# Altium project OwlRoundDelay.PrjPcb
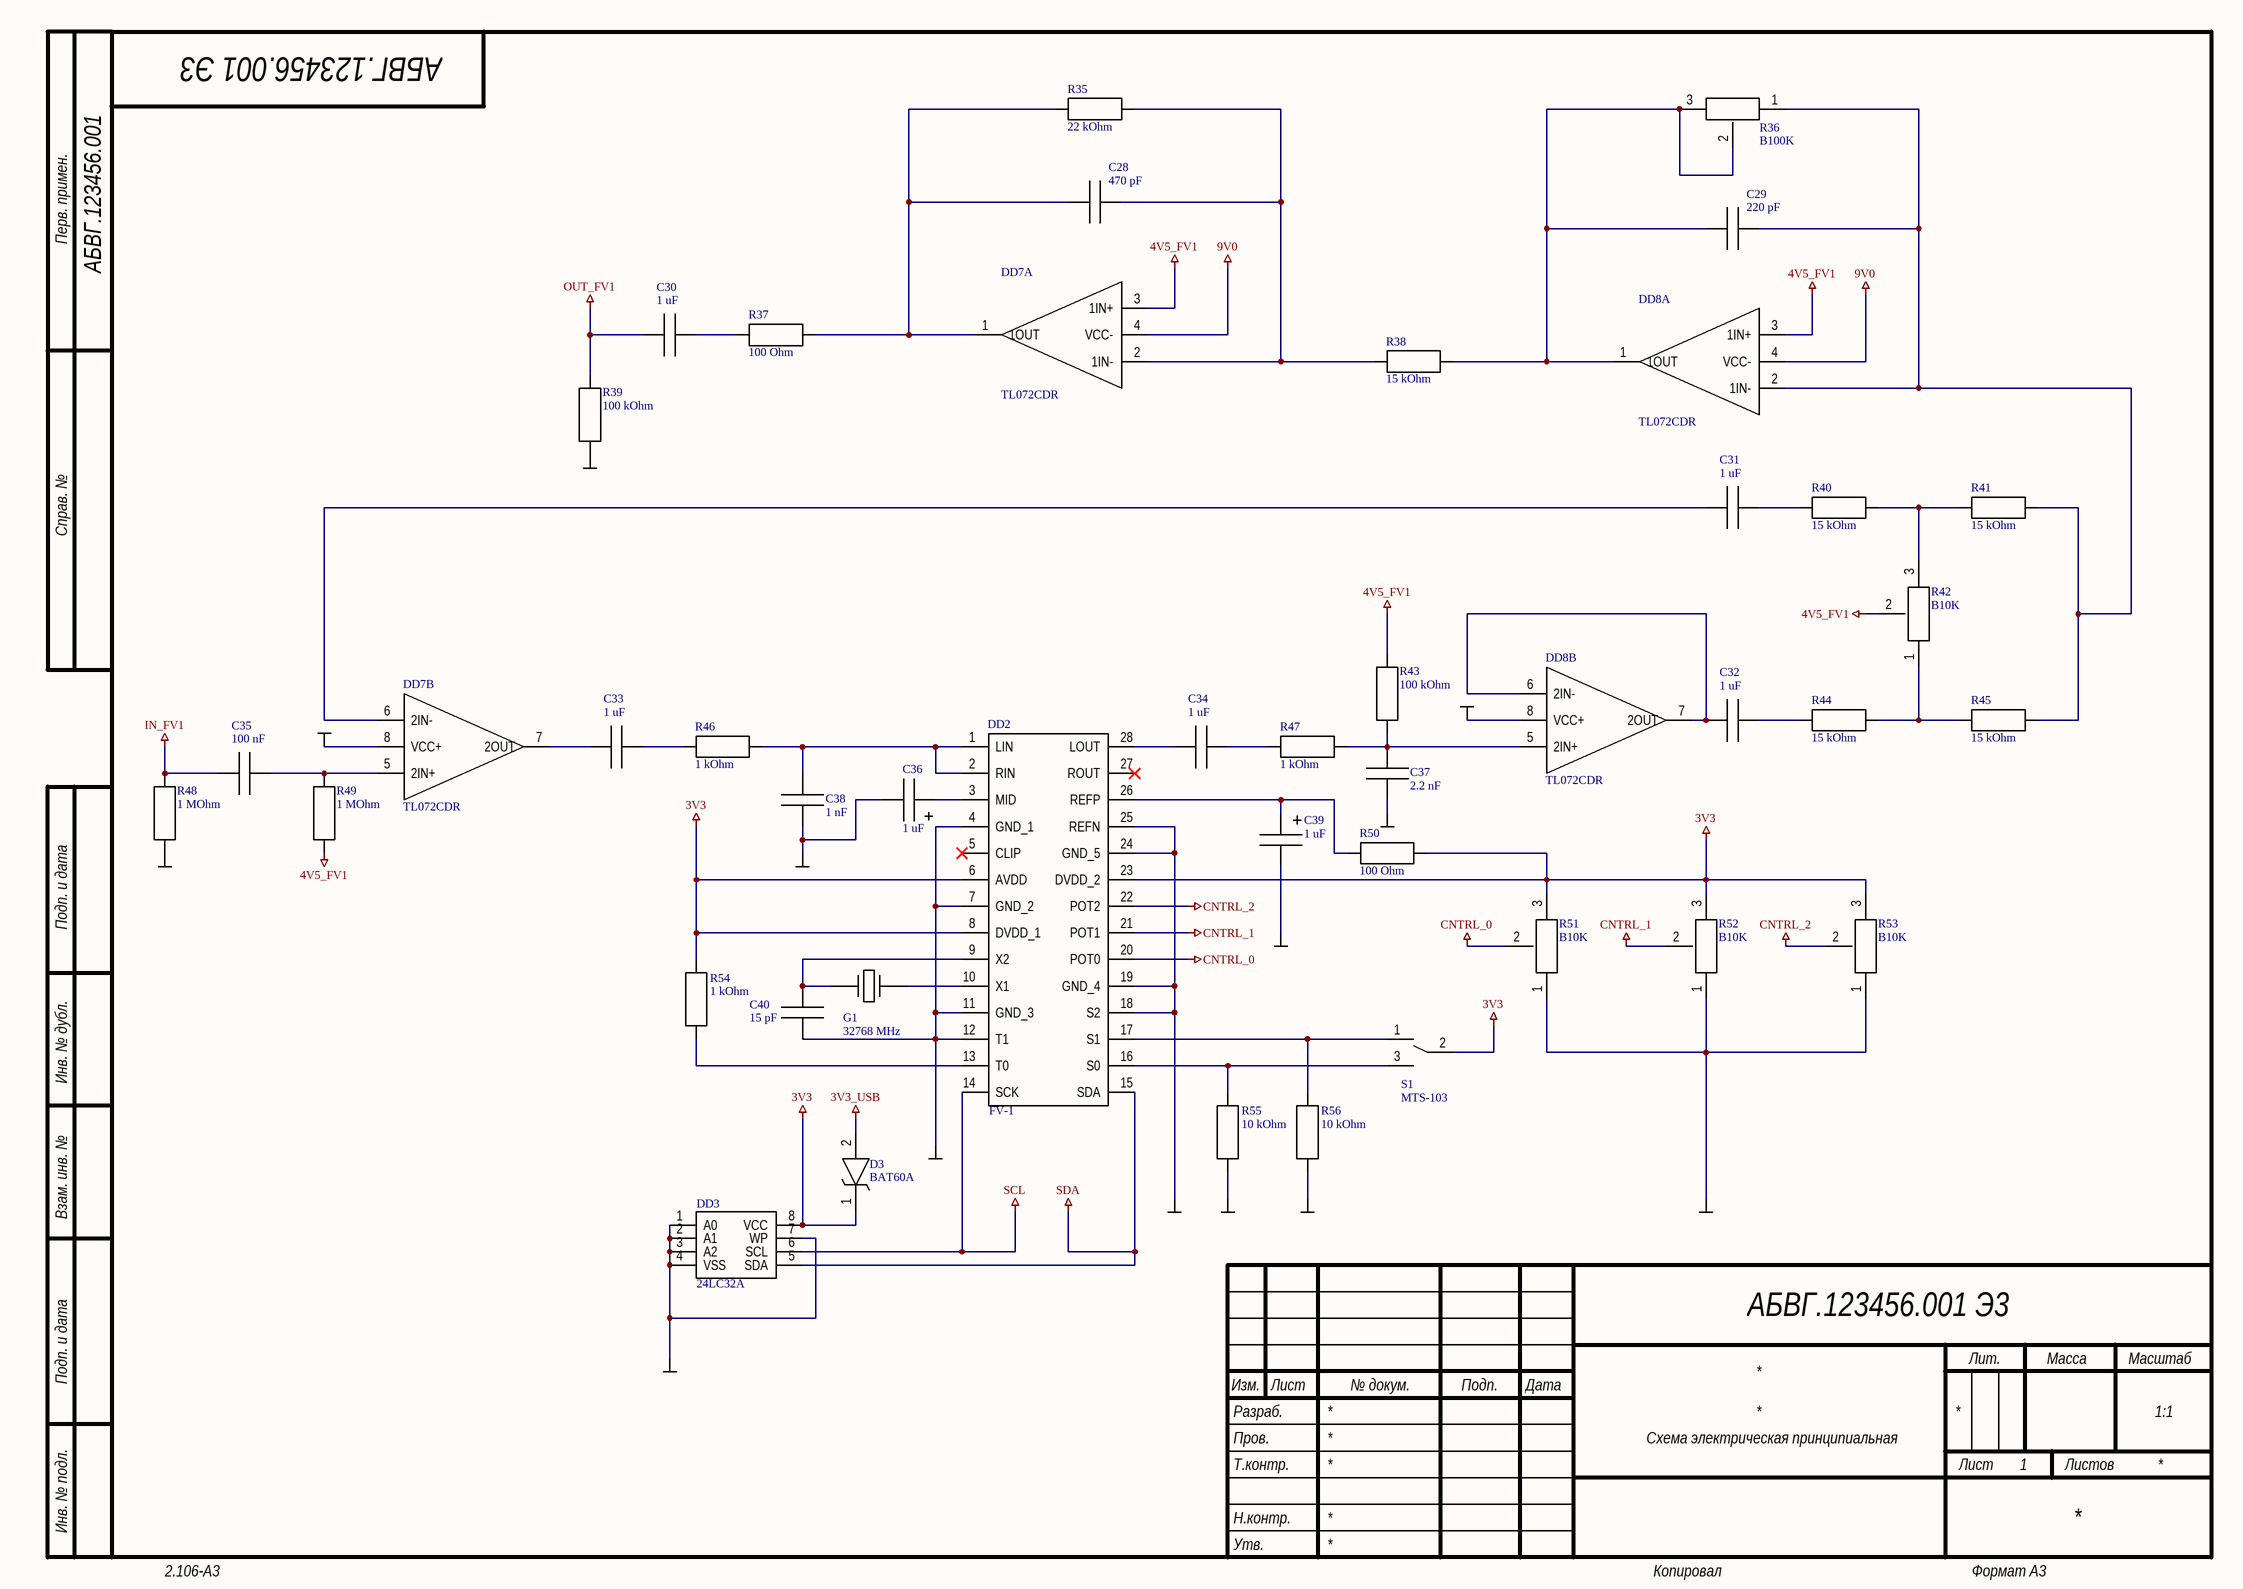
[diagram p0: ORD_FV1.SchDoc]
5 sheets, 130 parts. Net scope: global (net labels, ports and power ports of the same name join across sheets).
Board file: ORD_PCB.PcbDoc
Sheets:
  ORD_FV1.SchDoc
  ORD_PT2399.SchDoc
  ORD_POWER.SchDoc
  ORD_CH341A.SchDoc
  ORD_CONNECTORS.SchDoc

## Sheet ORD_FV1.SchDoc
size 420 x 297 mm; Address1: Address1; Address2: Address2; Address3: Address3; Address4: Address4; DocumentNumber: АБВГ.123456.001 Э3; SheetNumber: 1; Scale: 1:1; DocumentType: Схема электрическая принципиальная; FirstReferrence: АБВГ.123456.001

### Parts
C28  470 pF  [C0805[2012]]
C29  220 pF  [C0805[2012]]
C30  1 uF  [C0805[2012]]
C31  1 uF  [C0805[2012]]
C32  1 uF  [C0805[2012]]
C33  1 uF  [C0805[2012]]
C34  1 uF  [C0805[2012]]
C35  100 nF  [C0805[2012]]
C36  1 uF  [C3216_CASE-A]
C37  2.2 nF  [C0805[2012]]
C38  1 nF  [C0805[2012]]
C39  1 uF  [C3216_CASE-A]
C40  15 pF  [C0805[2012]]
D3  BAT60A  [SOD323]
DD2  FV-1  [SOIC28]
DD3  24LC32A  [DIP8_WITH_SOCKET]
DD7  TL072CDR  [SO8]  (parts A,B of 2)
DD8  TL072CDR  [SO8]  (parts A,B of 2)
G1  32768 MHz  [HC-49]
R35  22 kOhm  [R0805[2012]]
R36  B100K  [16K1]
R37  100 Ohm  [R0805[2012]]
R38  15 kOhm  [R0805[2012]]
R39  100 kOhm  [R0805[2012]]
R40  15 kOhm  [R0805[2012]]
R41  15 kOhm  [R0805[2012]]
R42  B10K  [16K1]
R43  100 kOhm  [R0805[2012]]
R44  15 kOhm  [R0805[2012]]
R45  15 kOhm  [R0805[2012]]
R46  1 kOhm  [R0805[2012]]
R47  1 kOhm  [R0805[2012]]
R48  1 MOhm  [R0805[2012]]
R49  1 MOhm  [R0805[2012]]
R50  100 Ohm  [R0805[2012]]
R51  B10K  [16K1]
R52  B10K  [16K1]
R53  B10K  [16K1]
R54  1 kOhm  [R0805[2012]]
R55  10 kOhm  [R0805[2012]]
R56  10 kOhm  [R0805[2012]]
S1  MTS-103  [MTS-103]

### Nets
3V3: D3.1(K) DD2.6(AVDD) DD2.8(DVDD_1) DD2.23(DVDD_2) DD3.8(VCC) R50.1 R51.3 R52.3 R53.3 R54.2 S1.2
3V3_USB: D3.2(A)
4V5_FV1: DD7.3(1IN+) DD8.3(1IN+) R42.2 R43.1 R49.1
9V0: DD7.4(VCC-) DD8.4(VCC-)
CNTRL_0: DD2.20(POT0) R51.2
CNTRL_1: DD2.21(POT1) R52.2
CNTRL_2: DD2.22(POT2) R53.2
GND: C36.2 C37.1 C38.1 C39.2 C40.2 DD2.4(GND_1) DD2.7(GND_2) DD2.11(GND_3) DD2.12(T1) DD2.18(S2) DD2.19(GND_4) DD2.24(GND_5) DD2.25(REFN) DD3.1(A0) DD3.2(A1) DD3.3(A2) DD3.4(VSS) DD3.7(WP) DD7.8(VCC+) DD8.8(VCC+) R39.1 R48.1 R51.1 R52.1 R53.1 R55.1 R56.1
IN_FV1: C35.1 R48.2
OUT_FV1: C30.1 R39.2
SCL: DD2.14(SCK) DD3.6(SCL)
SDA: DD2.15(SDA) DD3.5(SDA)
NetC28_1: C28.1 DD7.1(1OUT) R35.2 R37.1
NetC28_2: C28.2 DD7.2(1IN-) R35.1 R38.2
NetC29_1: C29.1 DD8.1(1OUT) R36.2 R36.3 R38.1
NetC29_2: C29.2 DD8.2(1IN-) R36.1 R41.1 R45.1
NetC30_2: C30.2 R37.2
NetC31_1: C31.1 DD7.6(2IN-)
NetC31_2: C31.2 R40.2
NetC32_1: C32.1 DD8.6(2IN-) DD8.7(2OUT)
NetC32_2: C32.2 R44.2
NetC33_1: C33.1 DD7.7(2OUT)
NetC33_2: C33.2 R46.2
NetC34_1: C34.1 DD2.28(LOUT)
NetC34_2: C34.2 R47.2
NetC35_2: C35.2 DD7.5(2IN+) R49.2
NetC36_1: C36.1 DD2.3(MID)
NetC37_2: C37.2 DD8.5(2IN+) R43.2 R47.1
NetC38_2: C38.2 DD2.1(LIN) DD2.2(RIN) R46.1
NetC39_1: C39.1 DD2.26(REFP) R50.2
NetC40_1: C40.1 DD2.9(X2) G1.1
NetDD2_10: DD2.10(X1) G1.2
NetDD2_13: DD2.13(T0) R54.1
NetDD2_16: DD2.16(S0) R55.2 S1.3
NetDD2_17: DD2.17(S1) R56.2 S1.1
NetR40_1: R40.1 R41.2 R42.3
NetR42_1: R42.1 R44.1 R45.2

Not connected (* = marked no-connect by the designer): DD2 5(CLIP)* 27(ROUT)*

### Notes on the sheet
- Перв. примен.
- Справ. №
- Подп. и дата
- Инв. № дубл.
- Взам. инв. №
- Разраб.
- Изм.
- Лист
- № докум.
- Подп.
- Дата
- Лит.
- Масса
- Масштаб
- Пров.
- Т.контр.
- Листов
- Инв. № подл.
- Утв.
- Н.контр.
- 2.106-A3
- Копировал
- Формат А3

### Library data of the parts
C28-C35 C37 C38 C40 = Capacitor: Manufacture: *; ManufacturerPartNumber: *; Power/Voltage: *; Quantity: *; Rem: *; TKE: *; Tolerance: *; Корпус: *; Примечание: *
  C28: Value: 470 pF
  C29: Value: 220 pF
  C30-C34: Value: 1 uF
  C35: Value: 100 nF
  C37: Value: 2.2 nF
  C38: Value: 1 nF
  C40: Value: 15 pF
C36 C39 = Capacitor_Pol: Manufacture: *; ManufacturerPartNumber: *; Power/Voltage: *; Quantity: *; Rem: *; TKE: *; Tolerance: *; Value: 1 uF; Корпус: *; Примечание: *
D3 = BAT60A: Diode Schottky 10V 3A Automotive 2-Pin SOD-323 T/R; Manufacturer_Part_Number: BAT60A; Arrow Part Number: BAT60A
DD2 = FV-1: FV-1 Reverb IC, Integrated Stereo ADC & DAC, Integrated Circuit, SOIC-28 300 MIL; Manufacturer_Name: Spin Semiconductor; Geometry.Height: 2.51mm; Manufacturer_Part_Number: FV-1 Reverb IC; Mouser Part Number: *; Mouser Price/Stock: *; RS Part Number: *; RS Price/Stock: *; Datasheet Link: http://www.spinsemi.com/Products/datasheets/spn1001/FV-1.pdf
DD3 = 24LC32A: 32K I2C Serial EEPROM with Quarter-Array Write-Protect; Manufacturer_Name: Microchip; Manufacturer_Part_Number: 24LC32AF-I/P; Allied_Number: 70570177; Mouser Part Number: 579-24LC32AF-I/P; Mouser Price/Stock: https://www.mouser.com/Search/Refine.aspx?Keyword=579-24LC32AF-I%2FP; RS Part Number: *; RS Price/Stock: *; Allied Price/Stock: https://www.alliedelec.com/microchip-technology-inc-24lc32af-i-p/70570177/; Datasheet Link: *
DD7 DD8 = TL072CDR: TL072CDR, Dual Operational Amplifier 4 MHz -18 to 18V, 8-Pin SO; Manufacturer_Name: STMicroelectronics; Manufacturer_Part_Number: LM358DT; Allied_Number: 70013708; Geometry.Height: 1.75mm; Mouser Part Number: 511-LM358DT; Mouser Price/Stock: https://www.mouser.com/Search/Refine.aspx?Keyword=511-LM358DT; RS Part Number: 7140827P; RS Price/Stock: http://uk.rs-online.com/web/p/products/7140827P; Allied Price/Stock: http://www.alliedelec.com/stmicroelectronics-lm358dt/70013708/; Datasheet Link: http://www.st.com/st-web-ui/static/active/en/resource/technical/document/datasheet/CD00000464.pdf
G1 = Crystal_2pin: Value: *
R35 R37-R41 R43-R50 R54-R56 = Resistor: Manufacture: *; ManufacturerPartNumber: *; Power/Voltage: *; Quantity: *; Rem: *; TKE: *; Tolerance: *; Корпус: *; Примечание: *
  R35: Value: 22 kOhm
  R37 R50: Value: 100 Ohm
  R38 R40 R41 R44 R45: Value: 15 kOhm
  R39 R43: Value: 100 kOhm
  R46 R47 R54: Value: 1 kOhm
  R48 R49: Value: 1 MOhm
  R55 R56: Value: 10 kOhm
R36 R42 R51-R53 = 16K1-B (Pot): Value: *; Function: *
S1 = MTS-103: Switch, ON-OFF-ON

## Sheet ORD_PT2399.SchDoc
size 420 x 297 mm; Address1: Address1; Address2: Address2; Address3: Address3; Address4: Address4; DocumentNumber: АБВГ.123456.001 Э3; SheetNumber: 1; Scale: 1:1; DocumentType: Схема электрическая принципиальная; FirstReferrence: АБВГ.123456.001
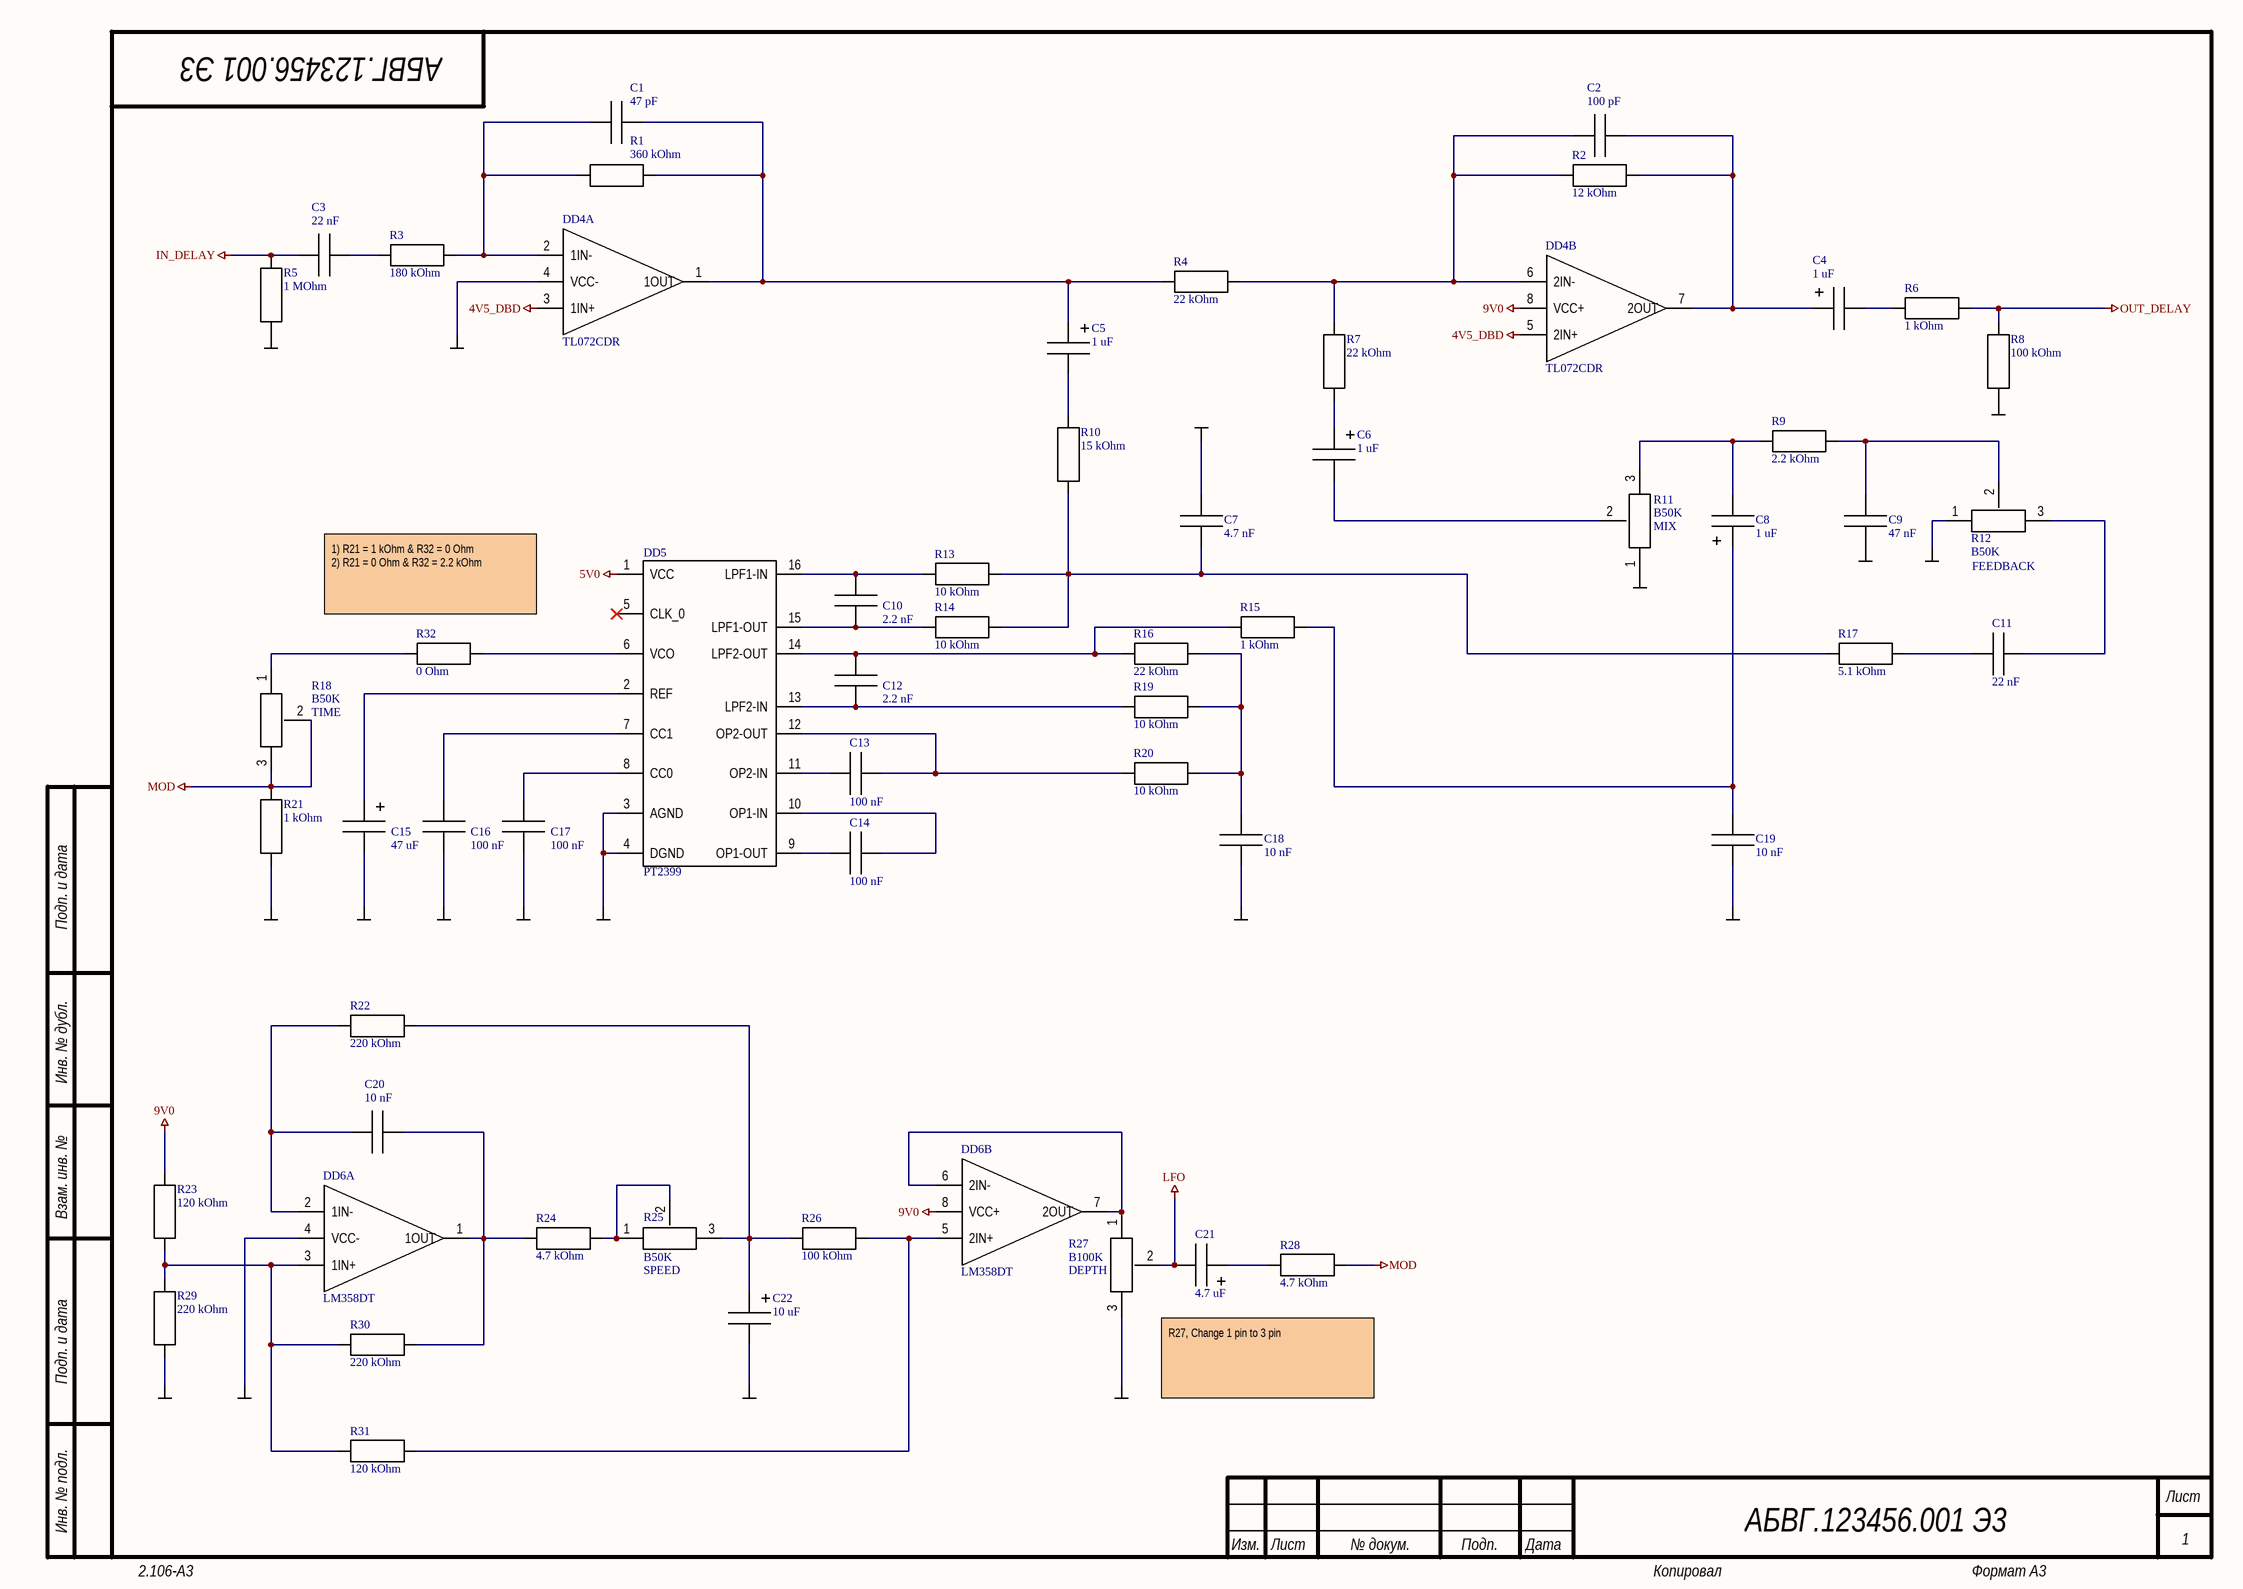
[diagram p1: ORD_PT2399.SchDoc]

### Parts
C1  47 pF  [C0805[2012]]
C2  100 pF  [C0805[2012]]
C3  22 nF  [C0805[2012]]
C4  1 uF  [C3216_CASE-A]
C5  1 uF  [C3216_CASE-A]
C6  1 uF  [C3216_CASE-A]
C7  4.7 nF  [C0805[2012]]
C8  1 uF  [C3216_CASE-A]
C9  47 nF  [C0805[2012]]
C10  2.2 nF  [C0805[2012]]
C11  22 nF  [C0805[2012]]
C12  2.2 nF  [C0805[2012]]
C13  100 nF  [C0805[2012]]
C14  100 nF  [C0805[2012]]
C15  47 uF  [C3216_CASE-A]
C16  100 nF  [C0805[2012]]
C17  100 nF  [C0805[2012]]
C18  10 nF  [C0805[2012]]
C19  10 nF  [C0805[2012]]
C20  10 nF  [C0805[2012]]
C21  4.7 uF  [C3216_CASE-A]
C22  10 uF  [C3216_CASE-A]
DD4  TL072CDR  [SO8]  (parts A,B of 2)
DD5  PT2399  [DIP16_with_Socket]
DD6  LM358DT  [SO8]  (parts A,B of 2)
R1  360 kOhm  [R0805[2012]]
R2  12 kOhm  [R0805[2012]]
R3  180 kOhm  [R0805[2012]]
R4  22 kOhm  [R0805[2012]]
R5  1 MOhm  [R0805[2012]]
R6  1 kOhm  [R0805[2012]]
R7  22 kOhm  [R0805[2012]]
R8  100 kOhm  [R0805[2012]]
R9  2.2 kOhm  [R0805[2012]]
R10  15 kOhm  [R0805[2012]]
R11  B50K  [16K1]
R12  B50K  [16K1]
R13  10 kOhm  [R0805[2012]]
R14  10 kOhm  [R0805[2012]]
R15  1 kOhm  [R0805[2012]]
R16  22 kOhm  [R0805[2012]]
R17  5.1 kOhm  [R0805[2012]]
R18  B50K  [16K1]
R19  10 kOhm  [R0805[2012]]
R20  10 kOhm  [R0805[2012]]
R21  1 kOhm  [R0805[2012]]
R22  220 kOhm  [R0805[2012]]
R23  120 kOhm  [R0805[2012]]
R24  4.7 kOhm  [R0805[2012]]
R25  B50K  [16K1]
R26  100 kOhm  [R0805[2012]]
R27  B100K  [16K1]
R28  4.7 kOhm  [R0805[2012]]
R29  220 kOhm  [R0805[2012]]
R30  220 kOhm  [R0805[2012]]
R31  120 kOhm  [R0805[2012]]
R32  0 Ohm  [R0805[2012]]

### Nets
4V5_DBD: DD4.3(1IN+) DD4.5(2IN+)
5V0: DD5.1(VCC)
9V0: DD4.8(VCC+) DD6.8(VCC+) R23.1
GND: C7.1 C9.2 C15.2 C16.1 C17.1 C18.2 C19.2 C22.2 DD4.4(VCC-) DD5.3(AGND) DD5.4(DGND) DD6.4(VCC-) R5.1 R8.2 R11.1 R12.1 R21.1 R27.3 R29.2
IN_DELAY: C3.1 R5.2
LFO: C21.2 R27.2
MOD: R18.2 R18.3 R21.2 R28.2
OUT_DELAY: R6.1 R8.1
NetC1_1: C1.1 DD4.2(1IN-) R1.2 R3.1
NetC1_2: C1.2 C5.1 DD4.1(1OUT) R1.1 R4.2
NetC2_1: C2.1 DD4.6(2IN-) R2.2 R4.1 R7.1
NetC2_2: C2.2 C4.1 DD4.7(2OUT) R2.1
NetC3_2: C3.2 R3.2
NetC4_2: C4.2 R6.2
NetC5_2: C5.2 R10.1
NetC6_1: C6.1 R7.2
NetC6_2: C6.2 R11.2
NetC7_2: C7.2 R10.2 R13.2 R14.2 R17.1
NetC8_1: C8.1 C19.1 R15.2
NetC8_2: C8.2 R9.1 R11.3
NetC9_1: C9.1 R9.2 R12.2
NetC10_1: C10.1 DD5.15(LPF1-OUT) R14.1
NetC10_2: C10.2 DD5.16(LPF1-IN) R13.1
NetC11_1: C11.1 R17.2
NetC11_2: C11.2 R12.3
NetC12_1: C12.1 DD5.13(LPF2-IN) R19.1
NetC12_2: C12.2 DD5.14(LPF2-OUT) R15.1 R16.1
NetC13_1: C13.1 DD5.12(OP2-OUT) R20.1
NetC13_2: C13.2 DD5.11(OP2-IN)
NetC14_1: C14.1 DD5.10(OP1-IN)
NetC14_2: C14.2 DD5.9(OP1-OUT)
NetC15_1: C15.1 DD5.2(REF)
NetC16_2: C16.2 DD5.7(CC1)
NetC17_2: C17.2 DD5.8(CC0)
NetC18_1: C18.1 R16.2 R19.2 R20.2
NetC20_1: C20.1 DD6.2(1IN-) R22.1
NetC20_2: C20.2 DD6.1(1OUT) R24.1 R30.2
NetC21_1: C21.1 R28.1
NetC22_1: C22.1 R22.2 R25.3 R26.1
NetDD5_6: DD5.6(VCO) R32.1
NetDD6_3: DD6.3(1IN+) R23.2 R29.1 R30.1 R31.1
NetDD6_5: DD6.5(2IN+) R26.2 R31.2
NetDD6_6: DD6.6(2IN-) DD6.7(2OUT) R27.1
NetR18_1: R18.1 R32.2
NetR24_2: R24.2 R25.1 R25.2

Not connected (* = marked no-connect by the designer): DD5 5(CLK_0)*

### Notes on the sheet
- (near R11) MIX
- (near R12) FEEDBACK
- (near R32) 1) R21 = 1 kOhm & R32 = 0 Ohm
  2) R21 = 0 Ohm & R32 = 2.2 kOhm
- (near R18) TIME
- (near R25) SPEED
- DEPTH
- R27, Change 1 pin to 3 pin
- Подп. и дата
- Инв. № дубл.
- Взам. инв. №
- Инв. № подл.
- Изм.
- Лист
- № докум.
- Подп.
- Дата
- 2.106-A3
- Копировал
- Формат А3

### Library data of the parts
C1-C3 C7 C9-C14 C16-C20 = Capacitor: Manufacture: *; ManufacturerPartNumber: *; Power/Voltage: *; Quantity: *; Rem: *; TKE: *; Tolerance: *; Корпус: *; Примечание: *
  C1: Value: 47 pF
  C2: Value: 100 pF
  C3 C11: Value: 22 nF
  C7: Value: 4.7 nF
  C9: Value: 47 nF
  C10 C12: Value: 2.2 nF
  C13 C14 C16 C17: Value: 100 nF
  C18-C20: Value: 10 nF
C4-C6 C8 C15 C21 C22 = Capacitor_Pol: Manufacture: *; ManufacturerPartNumber: *; Power/Voltage: *; Quantity: *; Rem: *; TKE: *; Tolerance: *; Корпус: *; Примечание: *
  C4-C6 C8: Value: 1 uF
  C15: Value: 47 uF
  C21: Value: 4.7 uF
  C22: Value: 10 uF
DD4 = TL072CDR: as DD7 on sheet ORD_FV1; Mouser Part Number: 511-LM358DT; Mouser Price/Stock: https://www.mouser.com/Search/Refine.aspx?Keyword=511-LM358DT; RS Part Number: 7140827P; RS Price/Stock: http://uk.rs-online.com/web/p/products/7140827P; Allied Price/Stock: http://www.alliedelec.com/stmicroelectronics-lm358dt/70013708/; Datasheet Link: http://www.st.com/st-web-ui/static/active/en/resource/technical/document/datasheet/CD00000464.pdf
DD5 = PT2399: Echo Processor IC; Manufacturer_Name: Princeton Technology Corp; Geometry.Height: 5.33mm; Manufacturer_Part_Number: PT2399; Mouser Part Number: *; Mouser Price/Stock: *; RS Part Number: *; RS Price/Stock: *; Datasheet Link: http://www.princeton.com.tw/Portals/0/Product/PT2399_1.pdf
DD6 = LM358DT: LM358DT, Dual Operational Amplifier 1.1MHz 5 to 28V, 8-Pin SO; Manufacturer_Name: STMicroelectronics; Allied_Number: 70013708; Geometry.Height: 1.75mm; Manufacturer_Part_Number: LM358DT; Mouser Part Number: 511-LM358DT; Mouser Price/Stock: https://www.mouser.com/Search/Refine.aspx?Keyword=511-LM358DT; RS Part Number: 7140827P; RS Price/Stock: http://uk.rs-online.com/web/p/products/7140827P; Allied Price/Stock: http://www.alliedelec.com/stmicroelectronics-lm358dt/70013708/; Datasheet Link: http://www.st.com/st-web-ui/static/active/en/resource/technical/document/datasheet/CD00000464.pdf
R1-R10 R13-R17 R19-R24 R26 R28-R32 = Resistor: Manufacture: *; ManufacturerPartNumber: *; Power/Voltage: *; Quantity: *; Rem: *; TKE: *; Tolerance: *; Корпус: *; Примечание: *
  R1: Value: 360 kOhm
  R2: Value: 12 kOhm
  R3: Value: 180 kOhm
  R4 R7 R16: Value: 22 kOhm
  R5: Value: 1 MOhm
  R6 R15 R21: Value: 1 kOhm
  R8 R26: Value: 100 kOhm
  R9: Value: 2.2 kOhm
  R10: Value: 15 kOhm
  R13 R14 R19 R20: Value: 10 kOhm
  R17: Value: 5.1 kOhm
  R22 R29 R30: Value: 220 kOhm
  R23 R31: Value: 120 kOhm
  R24 R28: Value: 4.7 kOhm
  R32: Value: 0 Ohm
R11 R12 R18 R25 R27 = 16K1-B (Pot): Value: *; Function: *

## Sheet ORD_POWER.SchDoc
size 420 x 297 mm; Address1: Address1; Address2: Address2; Address3: Address3; Address4: Address4; DocumentNumber: АБВГ.123456.001 Э3; SheetNumber: 1; Scale: 1:1; DocumentType: Схема электрическая принципиальная; FirstReferrence: АБВГ.123456.001
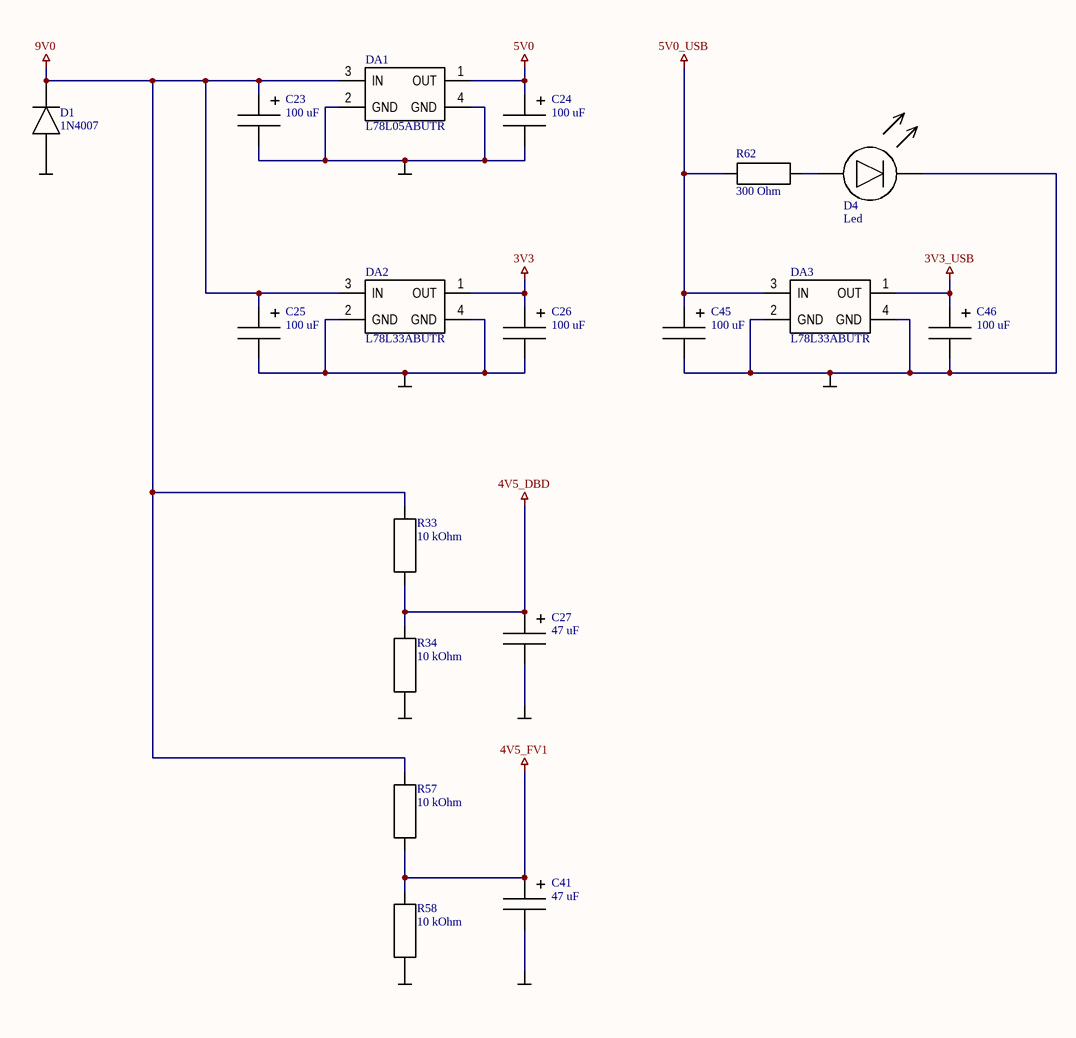
[diagram p2: ORD_POWER.SchDoc]

### Parts
C23  100 uF  [K50-35]
C24  100 uF  [K50-35]
C25  100 uF  [K50-35]
C26  100 uF  [K50-35]
C27  47 uF  [C3528_CASE-B]
C41  47 uF  [C3528_CASE-B]
C45  100 uF  [K50-35]
C46  100 uF  [K50-35]
D1  1N4007  [DO-41]
D4  Led  [LED]
DA1  L78L05ABUTR  [SOT-89]
DA2  L78L33ABUTR  [SOT-89]
DA3  L78L33ABUTR  [SOT-89]
R33  10 kOhm  [R0805[2012]]
R34  10 kOhm  [R0805[2012]]
R57  10 kOhm  [R0805[2012]]
R58  10 kOhm  [R0805[2012]]
R62  300 Ohm  [R0805[2012]]

### Nets
3V3: C26.1 DA2.1(OUT)
3V3_USB: C46.1 DA3.1(OUT)
4V5_DBD: C27.1 R33.1 R34.2
4V5_FV1: C41.1 R57.1 R58.2
5V0: C24.1 DA1.1(OUT)
5V0_USB: C45.1 DA3.3(IN) R62.2
9V0: C23.1 C25.1 D1.1(K) DA1.3(IN) DA2.3(IN) R33.2 R57.2
GND: C23.2 C24.2 C25.2 C26.2 C27.2 C41.2 C45.2 C46.2 D1.2(A) D4.2 DA1.2(GND) DA1.4(GND) DA2.2(GND) DA2.4(GND) DA3.2(GND) DA3.4(GND) R34.1 R58.1
NetD4_1: D4.1 R62.1

### Notes on the sheet
- Перв. примен.
- Справ. №
- Подп. и дата
- Инв. № дубл.
- Взам. инв. №
- Разраб.
- Изм.
- Лист
- № докум.
- Подп.
- Дата
- Лит.
- Масса
- Масштаб
- Пров.
- Т.контр.
- Листов
- Инв. № подл.
- Утв.
- Н.контр.
- 2.106-A3
- Копировал
- Формат А3

### Library data of the parts
C23-C27 C41 C45 C46 = Capacitor_Pol: Manufacture: *; ManufacturerPartNumber: *; Power/Voltage: *; Quantity: *; Rem: *; TKE: *; Tolerance: *; Корпус: *; Примечание: *
  C23-C26 C45 C46: Value: 100 uF
  C27 C41: Value: 47 uF
D1 = 1N4007: Geometry.Height: 1.35mm; Manufacturer_Name: 1N4007; Manufacturer_Part_Number: 1N4007
DA1 = L78L05ABUTR: Standard Regulator Pos 5V 0.1A L78L05ABUTR, Single Linear Voltage Regulator, 100mA 5 V, 3-Pin SOT-89; Manufacturer_Name: New Japan Radio; Manufacturer_Part_Number: NJM78L05UA-TE1; Allied_Number: R1030699; Mouser Part Number: *; Mouser Price/Stock: *; RS Part Number: 7139502P; RS Price/Stock: http://uk.rs-online.com/web/p/products/7139502P; Allied Price/Stock: https://www.alliedelec.com/new-japan-radio-njm78l05ua-te1/R1030699/; Datasheet Link: http://uk.rs-online.com/web/p/products/7139502
DA2 DA3 = L78L33ABUTR: Standard Regulator Pos 3.3V 0.1A L78L33ABUTR, Single Linear Voltage Regulator, 100mA 3.3 V, 3-Pin SOT-89; Manufacturer_Name: New Japan Radio; Manufacturer_Part_Number: NJM78L05UA-TE1; Allied_Number: R1030699; Mouser Part Number: *; Mouser Price/Stock: *; RS Part Number: 7139502P; RS Price/Stock: http://uk.rs-online.com/web/p/products/7139502P; Allied Price/Stock: https://www.alliedelec.com/new-japan-radio-njm78l05ua-te1/R1030699/; Datasheet Link: http://uk.rs-online.com/web/p/products/7139502
R33 R34 R57 R58 R62 = Resistor: Manufacture: *; ManufacturerPartNumber: *; Power/Voltage: *; Quantity: *; Rem: *; TKE: *; Tolerance: *; Корпус: *; Примечание: *
  R33 R34 R57 R58: Value: 10 kOhm
  R62: Value: 300 Ohm
D4 = Led: ManufacturerPartNumber: *

## Sheet ORD_CH341A.SchDoc
size 420 x 297 mm; Address1: Address1; Address2: Address2; Address3: Address3; Address4: Address4; DocumentNumber: АБВГ.123456.001 Э3; SheetNumber: 1; Scale: 1:1; DocumentType: Схема электрическая принципиальная; FirstReferrence: АБВГ.123456.001
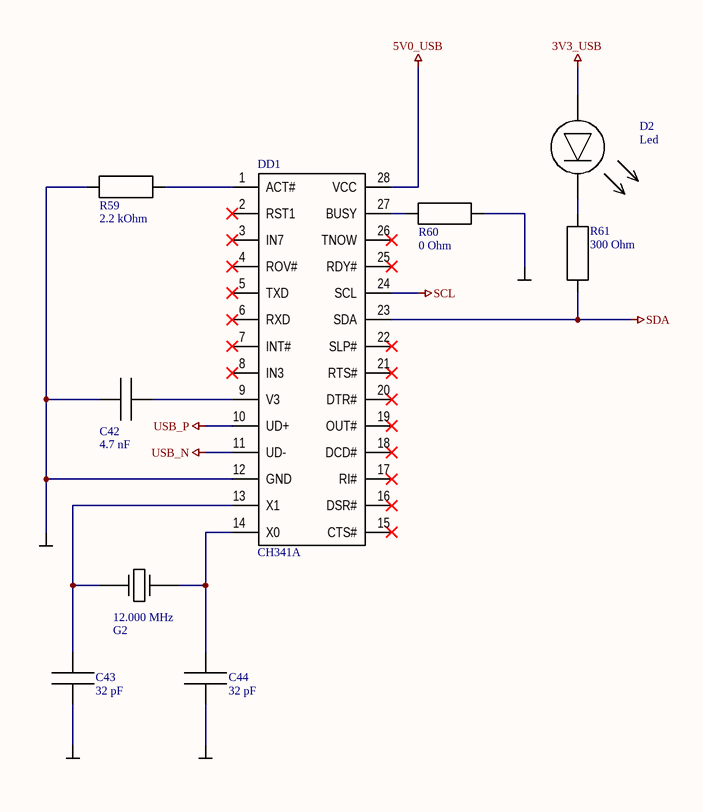
[diagram p3: ORD_CH341A.SchDoc]

### Parts
C42  4.7 nF  [C0603[1608]]
C43  32 pF  [C0603[1608]]
C44  32 pF  [C0603[1608]]
D2  Led  [LED]
DD1  CH341A  [SOIC28]
G2  12.000 MHz  [HC-49]
R59  2.2 kOhm  [R0805[2012]]
R60  0 Ohm  [R0603[1608]]
R61  300 Ohm  [R0603[1608]]

### Nets
3V3_USB: D2.1
5V0_USB: DD1.28(VCC)
GND: C42.1 C43.1 C44.1 DD1.12(GND) R59.1 R60.2
SCL: DD1.24(SCL)
SDA: DD1.23(SDA) R61.1
USB_N: DD1.11(UD-)
USB_P: DD1.10(UD+)
NetC42_2: C42.2 DD1.9(V3)
NetC43_2: C43.2 DD1.13(X1) G2.1
NetC44_2: C44.2 DD1.14(X0) G2.2
NetD2_2: D2.2 R61.2
NetDD1_1: DD1.1(ACT#) R59.2
NetDD1_27: DD1.27(BUSY) R60.1

Not connected (* = marked no-connect by the designer): DD1 2(RST1)* 3(IN7)* 4(ROV#)* 5(TXD)* 6(RXD)* 7(INT#)* 8(IN3)* 15(CTS#)* 16(DSR#)* 17(RI#)* 18(DCD#)* 19(OUT#)* 20(DTR#)* 21(RTS#)* 22(SLP#)* 25(RDY#)* 26(TNOW)*

### Notes on the sheet
- Перв. примен.
- Справ. №
- Подп. и дата
- Инв. № дубл.
- Взам. инв. №
- Разраб.
- Изм.
- Лист
- № докум.
- Подп.
- Дата
- Лит.
- Масса
- Масштаб
- Пров.
- Т.контр.
- Листов
- Инв. № подл.
- Утв.
- Н.контр.
- 2.106-A3
- Копировал
- Формат А3

### Library data of the parts
C42-C44 = Capacitor: Manufacture: *; ManufacturerPartNumber: *; Power/Voltage: *; Quantity: *; Rem: *; TKE: *; Tolerance: *; Корпус: *; Примечание: *
  C42: Value: 4.7 nF
  C43 C44: Value: 32 pF
DD1 = CH341A: USB Bus Convert Chip CH341A; Manufacturer_Name: Spin Semiconductor; Manufacturer_Part_Number: FV-1 Reverb IC; Geometry.Height: 2.51mm; Mouser Part Number: *; Mouser Price/Stock: *; RS Part Number: *; RS Price/Stock: *; Datasheet Link: http://www.spinsemi.com/Products/datasheets/spn1001/FV-1.pdf
G2 = Crystal_2pin: Value: *
R59-R61 = Resistor: Manufacture: *; ManufacturerPartNumber: *; Power/Voltage: *; Quantity: *; Rem: *; TKE: *; Tolerance: *; Корпус: *; Примечание: *
  R59: Value: 2.2 kOhm
  R60: Value: 0 Ohm
  R61: Value: 300 Ohm
D2 = Led: ManufacturerPartNumber: *

## Sheet ORD_CONNECTORS.SchDoc
size 420 x 297 mm; Address1: Address1; Address2: Address2; Address3: Address3; Address4: Address4; DocumentNumber: АБВГ.123456.001 Э3; SheetNumber: 1; Scale: 1:1; DocumentType: Схема электрическая принципиальная; FirstReferrence: АБВГ.123456.001
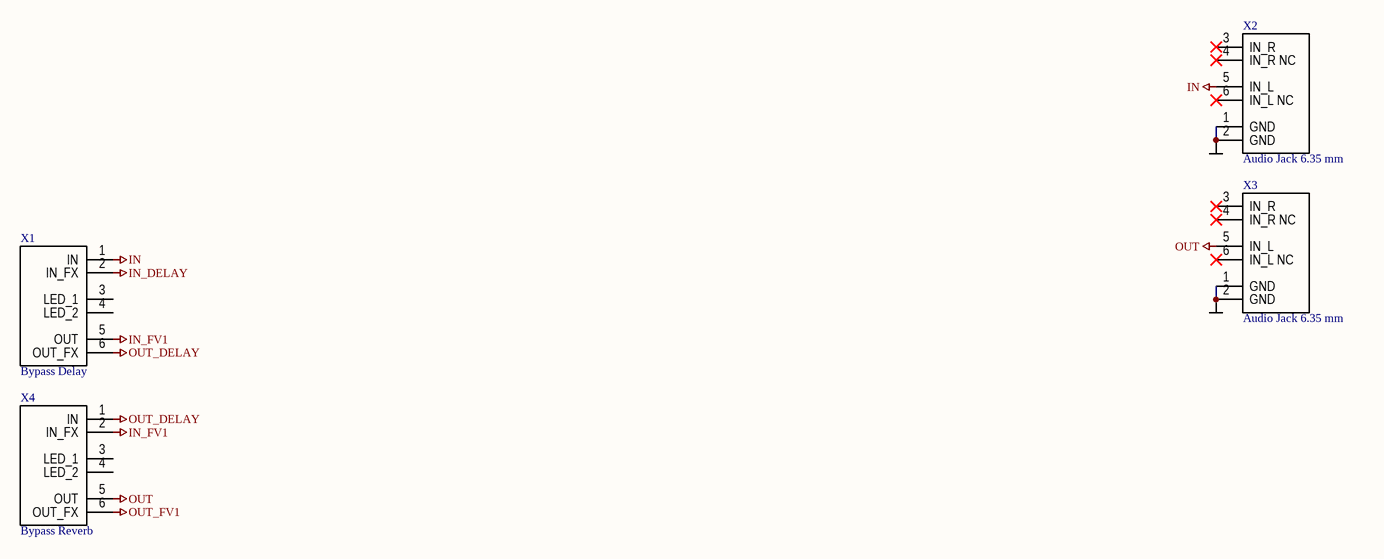
[diagram p4: ORD_CONNECTORS.SchDoc]

### Parts
X1  Bypass Delay  [BYPASS PANEL]
X2  Audio Jack 6.35 mm  [audio jack]
X3  Audio Jack 6.35 mm  [audio jack]
X4  Bypass Reverb  [BYPASS PANEL]

### Nets
GND: X2.1(GND) X2.2(GND) X3.1(GND) X3.2(GND)
IN: X1.1(IN) X2.5(IN_L)
IN_DELAY: X1.2(IN_FX)
IN_FV1: X1.5(OUT) X4.2(IN_FX)
OUT: X3.5(IN_L) X4.5(OUT)
OUT_DELAY: X1.6(OUT_FX) X4.1(IN)
OUT_FV1: X4.6(OUT_FX)

Not connected (* = marked no-connect by the designer): X1 3(LED_1) 4(LED_2); X2 3(IN_R)* 4(IN_R_NC)* 6(IN_L_NC)*; X3 3(IN_R)* 4(IN_R_NC)* 6(IN_L_NC)*; X4 3(LED_1) 4(LED_2)

### Notes on the sheet
- Перв. примен.
- Справ. №
- Подп. и дата
- Инв. № дубл.
- Взам. инв. №
- Разраб.
- Изм.
- Лист
- № докум.
- Подп.
- Дата
- Лит.
- Масса
- Масштаб
- Пров.
- Т.контр.
- Листов
- Инв. № подл.
- Утв.
- Н.контр.
- 2.106-A3
- Копировал
- Формат А3

### Library data of the parts
X1 X4 = Bypass: Rele or 3PDT
X2 X3 = Audio Jack

## Nets that join several sheets
3V3: ORD_FV1 (11 pins), ORD_POWER (C26.1 DA2.1)
3V3_USB: ORD_FV1 (D3.2), ORD_POWER (C46.1 DA3.1), ORD_CH341A (D2.1)
4V5_DBD: ORD_PT2399 (DD4.3 DD4.5), ORD_POWER (C27.1 R33.1 R34.2)
4V5_FV1: ORD_FV1 (5 pins), ORD_POWER (C41.1 R57.1 R58.2)
5V0: ORD_PT2399 (DD5.1), ORD_POWER (C24.1 DA1.1)
5V0_USB: ORD_POWER (C45.1 DA3.3 R62.2), ORD_CH341A (DD1.28)
9V0: ORD_FV1 (DD7.4 DD8.4), ORD_PT2399 (DD4.8 DD6.8 R23.1), ORD_POWER (7 pins)
GND: ORD_FV1 (27 pins), ORD_PT2399 (19 pins), ORD_POWER (18 pins), ORD_CH341A (6 pins), ORD_CONNECTORS (X2.1 X2.2 X3.1 X3.2)
IN_DELAY: ORD_PT2399 (C3.1 R5.2), ORD_CONNECTORS (X1.2)
IN_FV1: ORD_FV1 (C35.1 R48.2), ORD_CONNECTORS (X1.5 X4.2)
OUT_DELAY: ORD_PT2399 (R6.1 R8.1), ORD_CONNECTORS (X1.6 X4.1)
OUT_FV1: ORD_FV1 (C30.1 R39.2), ORD_CONNECTORS (X4.6)
SCL: ORD_FV1 (DD2.14 DD3.6), ORD_CH341A (DD1.24)
SDA: ORD_FV1 (DD2.15 DD3.5), ORD_CH341A (DD1.23 R61.1)